# EAGLE design tubitak (EAGLE 9.6.2)
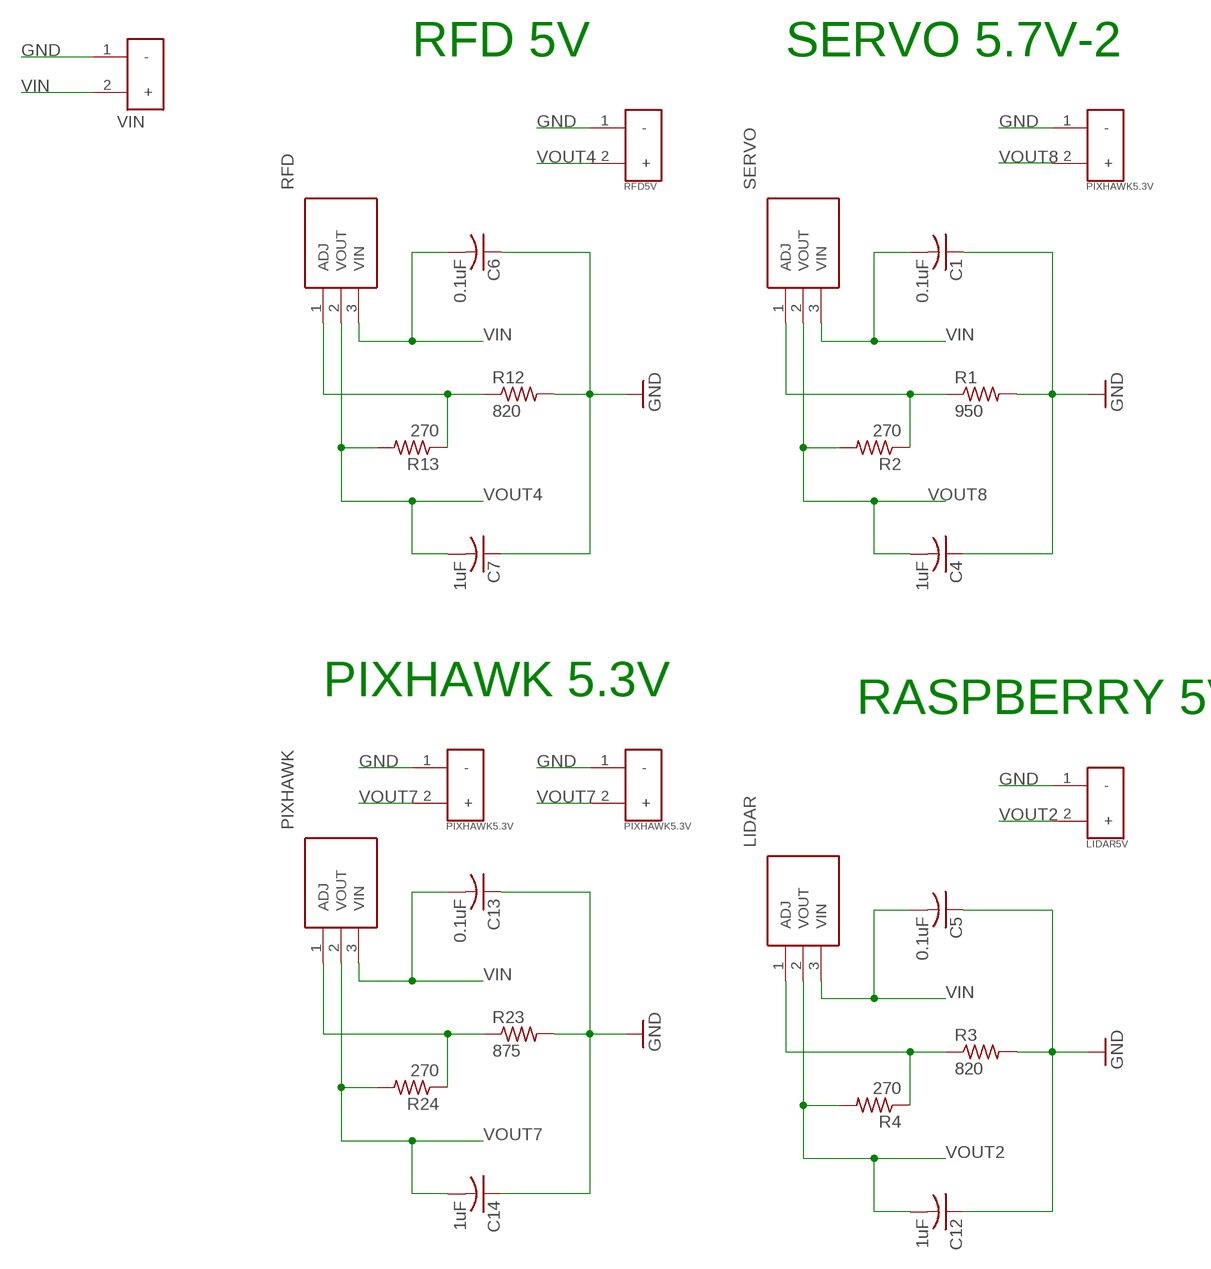
[diagram p0: schematic, sheet 1]

## Parts
C1  0.1uF  C-USC0402K  [C0402K]
C4  1uF  C-USC0402K  [C0402K]
C5  0.1uF  C-USC0402K  [C0402K]
C6  0.1uF  C-USC0402K  [C0402K]
C7  1uF  C-USC0402K  [C0402K]
C12  1uF  C-USC0402K  [C0402K]
C13  0.1uF  C-USC0402K  [C0402K]
C14  1uF  C-USC0402K  [C0402K]
J3  VIN  XT60-M  [AMASS_XT60-M]
PIXHAWK  PIXHAWK  LM338T_NOPB  [TO254P470X1028X1955-3P]
PIXHAWK5.3V-1  PIXHAWK5.3V  XT60-M  [AMASS_XT60-M]
PIXHAWK5.3V-2  PIXHAWK5.3V  XT60-M  [AMASS_XT60-M]
R1  950  R-US_R0805  [R0805]
R2  270  R-US_R0805  [R0805]
R3  820  R-US_R0805  [R0805]
R4  270  R-US_R0805  [R0805]
R12  820  R-US_R0805  [R0805]
R13  270  R-US_R0805  [R0805]
R23  875  R-US_R0805  [R0805]
R24  270  R-US_R0805  [R0805]
RASPBERRY  LIDAR  LM338T_NOPB  [TO254P470X1028X1955-3P]
RASPBERRY5V  LIDAR5V  XT60-M  [AMASS_XT60-M]
RFD  RFD  LM338T_NOPB  [TO254P470X1028X1955-3P]
RFD5V  RFD5V  XT60-M  [AMASS_XT60-M]
SERVO5.7V-2  PIXHAWK5.3V  XT60-M  [AMASS_XT60-M]
SERVO-2  SERVO  LM338T_NOPB  [TO254P470X1028X1955-3P]

## Nets
GND [asda]: C1.1 C4.1 C5.1 C6.1 C7.1 C12.1 C13.1 C14.1 J3.1(-) PIXHAWK5.3V-1.1(-) PIXHAWK5.3V-2.1(-) R1.2 R3.2 R12.2 R23.2 RASPBERRY5V.1(-) RFD5V.1(-) SERVO5.7V-2.1(-)
N$1: R1.1 R2.1 SERVO-2.1(ADJ)
N$2: R3.1 R4.1 RASPBERRY.1(ADJ)
N$11: R12.1 R13.1 RFD.1(ADJ)
N$17: PIXHAWK.1(ADJ) R23.1 R24.1
VIN [asda]: C1.2 C5.2 C6.2 C13.2 J3.2(+) PIXHAWK.3(VIN) RASPBERRY.3(VIN) RFD.3(VIN) SERVO-2.3(VIN)
VOUT2: C12.2 R4.2 RASPBERRY5V.2(+) RASPBERRY.2(VOUT)
VOUT4: C7.2 R13.2 RFD5V.2(+) RFD.2(VOUT)
VOUT7: C14.2 PIXHAWK5.3V-1.2(+) PIXHAWK5.3V-2.2(+) PIXHAWK.2(VOUT) R24.2
VOUT8: C4.2 R2.2 SERVO5.7V-2.2(+) SERVO-2.2(VOUT)

## Notes on the sheet
- RFD 5V | SERVO 5.7V-2
- PIXHAWK 5.3V
- RASPBERRY 5V

## Library data of the parts
C1 C4-C7 C12-C14 = adafruit:C-US: CAPACITOR, American symbol
J3 PIXHAWK5.3V-1 PIXHAWK5.3V-2 RASPBERRY5V RFD5V SERVO5.7V-2 = XT60-M:XT60-M: DC supply; XT60; male; PIN:2; for cable; soldered; 60A; 500V; AVAILABILITY: Unavailable; DESCRIPTION: Plug; DC supply; XT60; male; PIN: 2; for cable; soldered; 30A; 500V; MF: AMASS; MP: XT60-M; PACKAGE: Package; PRICE: None
PIXHAWK RASPBERRY RFD SERVO-2 = LM338T_NOPB:LM338T_NOPB: 5 Amp Adjustable Regulator LM338T LM338T/NOPB, Voltage Regulator, 5A Adjustable 1.2 32 V, 25W, 3-Pin TO-220 Source: Datasheet <http://www.ti.com/lit/ds/symlink/lm338.pdf>; ARROW_PART_NUMBER: LM338T/NOPB; ARROW_PRICE-STOCK: https://www.arrow.com/en/products/lm338tnopb/texas-instruments; DESCRIPTION: 5 Amp Adjustable Regulator LM338T LM338T/NOPB, Voltage Regulator, 5A Adjustable 1.2 32 V, 25W, 3-Pin TO-220; HEIGHT: 4.7mm; MANUFACTURER_NAME: Texas Instruments; MANUFACTURER_PART_NUMBER: LM338T/NOPB; MOUSER_PART_NUMBER: 926-LM338T/NOPB; MOUSER_PRICE-STOCK: https://www.mouser.co.uk/ProductDetail/Texas-Instruments/LM338T-NOPB?qs=X1J7HmVL2ZENaH7%2FMvkSlw%3D%3D
R1-R4 R12 R13 R23 R24 = adafruit:R-US_: RESISTOR, American symbol

## Net classes
1 asda: width 0.7 mm

## Board
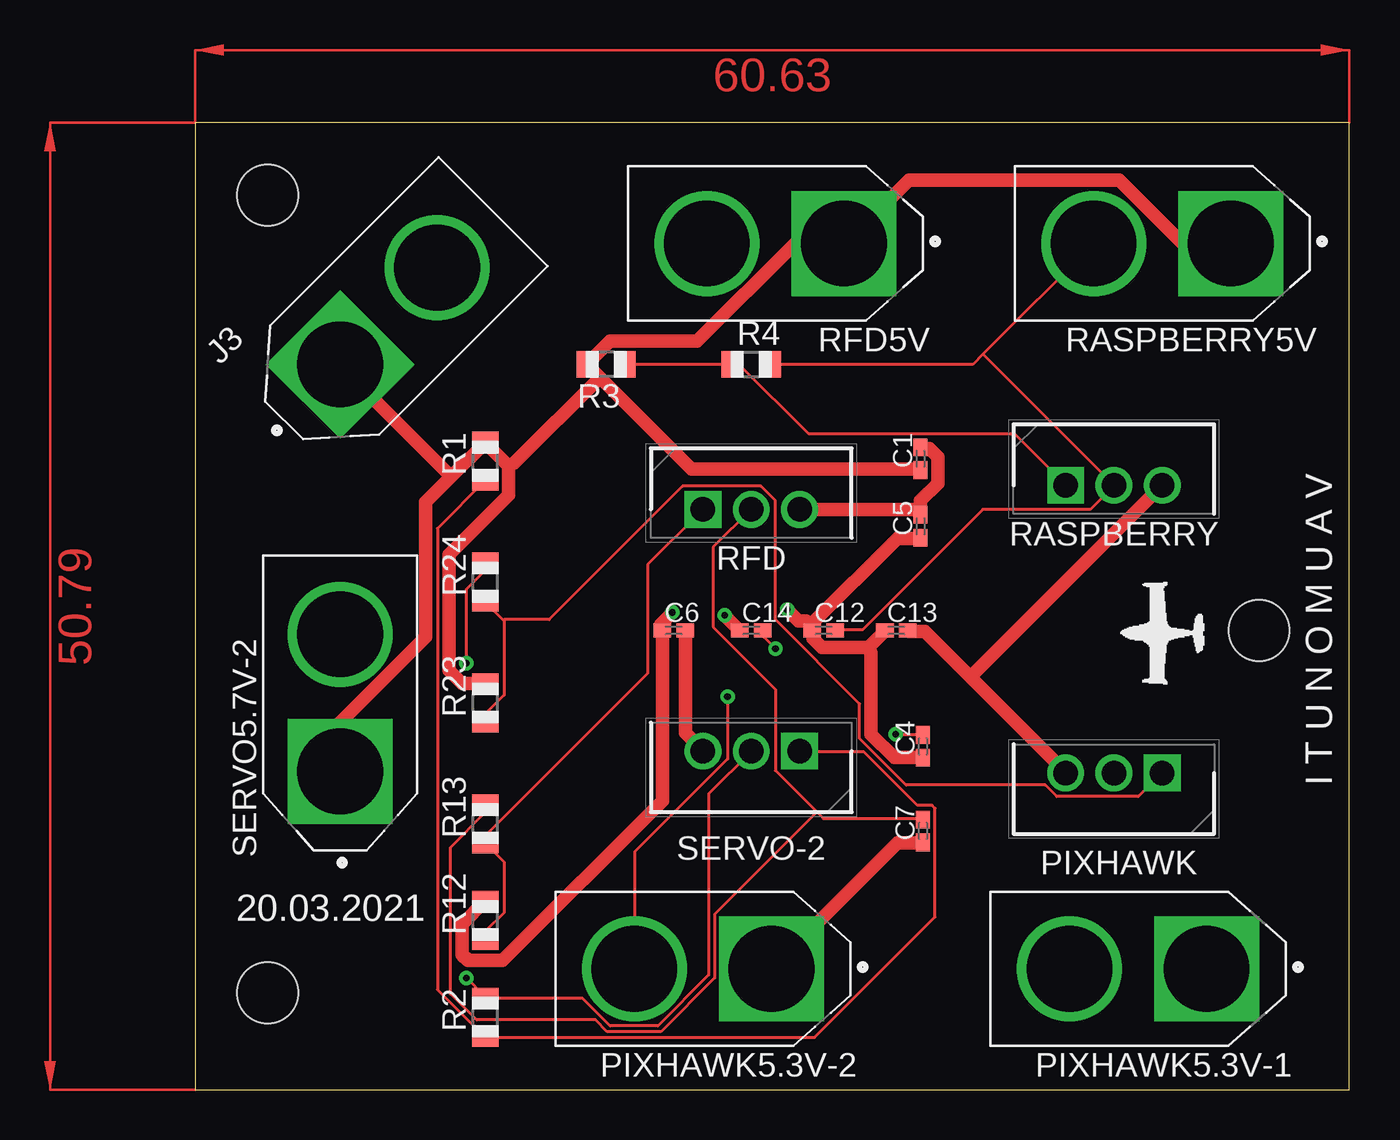
[diagram p1: board, top side]
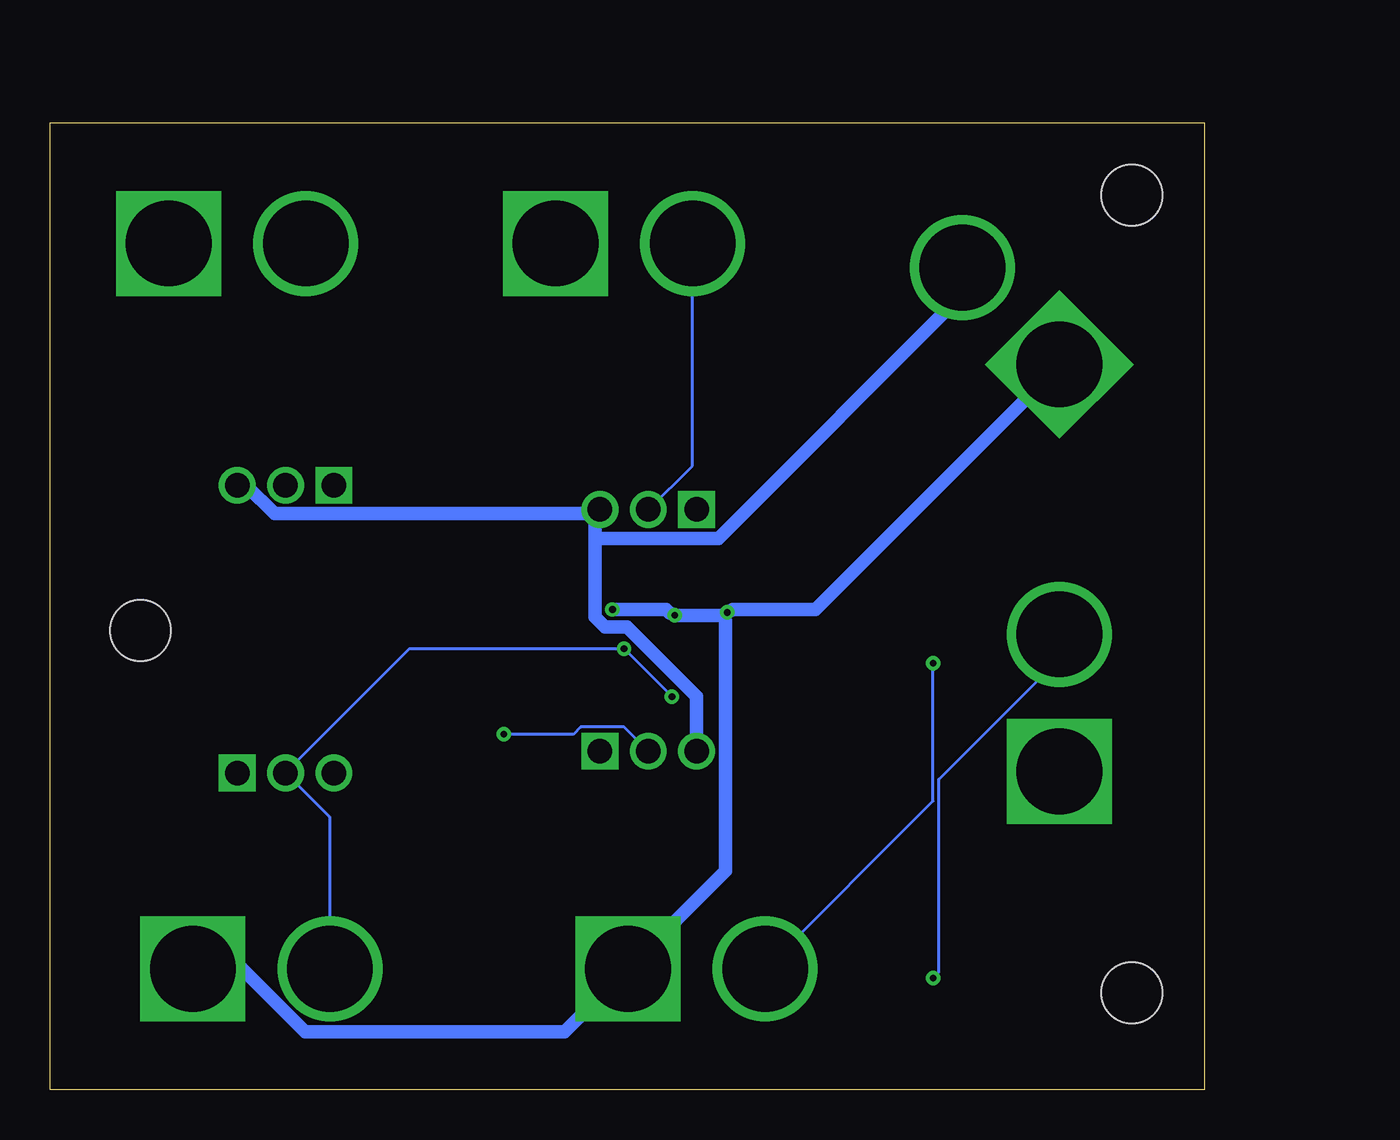
[diagram p2: board, bottom side, seen from below]

Size 60.63 x 50.79 mm. Coordinates in mm from the lower left corner, seen from the top.
Outline: 0,0 60.63,0 60.63,50.79 0,50.79 0,0
Copper layers (1*16): Top 0.035mm / dielectric 1.5mm / Bottom 0.035mm
Design rules "default": minimum track width 6mil, minimum drill 0.35mm, track to track 6mil, track to pad 6mil, pad to pad 6mil, via to via 6mil, smd to smd 6mil, copper to edge 40mil, drill to drill 6mil, minimum pad ring 10mil, minimum via ring 8mil, stop-mask expansion 4mil, vias tented up to drill 0mil, thermal gap 10mil
Holes 3.2 mm at 3.81,46.99 3.81,5.08 55.88,24.13

### Footprints (pad centres in the part's own frame; a part is rotated, then mirrored left to right if it is on the bottom)
C0402K = smd 0.925 x 0.74: 1 -0.6,0; 2 0.6,0
AMASS_XT60-M = drill 4.5 square: 1 -3.6,0 | drill 4.5: 2 3.6,0
TO254P470X1028X1955-3P = drill 1.29 pad 1.935 square: 1 0,0 | drill 1.29 pad 1.935: 2 2.54,0; 3 5.08,0
R0805 = smd 1.1 x 1.4: 1 -1,0; 2 1,0

### Placement (x,y rotation side)
C1  38.1,33.15 90 top
C4  38.23,18.03 90 top
C5  38.1,29.59 90 top
C6  25.15,24.13 0 top
C7  38.23,13.59 90 top
C12  33.02,24.13 0 top
C13  36.83,24.13 0 top
C14  29.21,24.13 0 top
J3  10.16,40.64 45 top
PIXHAWK  50.8,16.64 180 top
PIXHAWK5.3V-1  49.53,6.35 180 top
PIXHAWK5.3V-2  26.67,6.35 180 top
R1  15.24,33.02 90 top
R2  15.24,3.81 90 top
R3  21.59,38.1 180 top
R4  29.21,38.1 0 top
R12  15.24,8.89 90 top
R13  15.24,13.97 90 top
R23  15.24,20.32 90 top
R24  15.24,26.67 90 top
RASPBERRY  45.72,31.75 0 top
RASPBERRY5V  50.8,44.45 180 top
RFD  26.67,30.48 0 top
RFD5V  30.48,44.45 180 top
SERVO5.7V-2  7.62,20.32 90 top
SERVO-2  31.75,17.78 180 top

### Tracks (layer width: path | path; a pad name or v marks a point on that pad's centre or on a via)
GND  (via drill 0.35)
  Top 0.7: 35.36,23.24 32.92,23.24 32.46,23.7 32.46,24.08 C12.1 32.38,24.46 | 35.36,23.24 36.2,24.08 C13.1 | 32.38,24.46 36.88,28.96 38.1,28.96 C5.1 | C4.1 38.18,17.45 36.73,17.45 35.51,18.67 35.51,22.94 35.36,23.24 | R12.2 15.24,9.91 14.02,8.69 14.02,7.09 14.33,6.78 16.15,6.78 24.54,15.16 24.54,24.08 C6.1 24.46,24.46 v25.07,25.07 | v27.81,24.92 28.57,24.16 C14.1 | v31.09,25.22 31.7,24.61 32.08,24.61 32.38,24.46 | C7.1 38.18,12.95 36.88,12.95 30.33,6.4 PIXHAWK5.3V-2.1 | 16.46,32.77 16.46,31.24 13.34,28.12 13.34,22.02 14.02,21.34 15.24,21.34 R23.2 | 16.46,32.77 15.24,33.98 R1.2 15.01,33.76 13.45,32.19 | 21.26,37.41 20.57,38.1 R3.2 20.8,38.33 21.79,39.32 26.36,39.32 31.47,44.42 34.06,44.42 RFD5V.1 34.37,44.65 37.49,47.78 48.54,47.78 51.82,44.5 54.33,44.5 RASPBERRY5V.1 | 21.26,37.41 26.06,32.61 38.1,32.61 C1.1 | 21.26,37.41 16.76,32.92 16.46,32.77 | SERVO5.7V-2.1 7.62,19.28 12.12,23.77 12.12,30.86 13.45,32.19 | 13.45,32.19 7.62,38.02 J3.1
  Bottom 0.7: 25.22,24.92 v27.81,24.92 28.12,25.07 28.27,25.22 v31.09,25.22 | 25.22,24.92 v25.07,25.07 24.77,25.22 20.42,25.22 7.62,38.02 J3.1 | PIXHAWK5.3V-1.1 53.11,6.33 50.52,6.33 47.24,3.05 33.6,3.05 30.33,6.33 PIXHAWK5.3V-2.1 30.02,6.63 25.15,11.51 25.15,24.61 25.22,24.92
N$1
  Top 0.152: R1.1 15.24,32 12.72,29.49 12.72,5.26 14.63,3.35 14.71,3.35 R2.1 15.24,2.74 32.54,2.74 38.86,9.07 38.86,14.78 38.71,14.94 37.95,14.94 35.13,17.75 31.77,17.75 SERVO-2.1
N$2
  Top 0.152: R3.1 R4.1 28.57,38.1 32.23,34.44 43.05,34.44 45.72,31.77 RASPBERRY.1
N$11
  Top 0.152: R12.1 15.24,8.31 16.23,9.3 16.23,11.96 15.24,12.95 R13.1 15.24,13.34 23.77,21.87 23.77,27.58 RFD.1
N$17
  Top 0.152: R23.1 15.24,19.74 16.23,20.73 16.23,24.61 16.19,24.65 | 16.19,24.65 15.24,25.6 R24.1 | 16.19,24.65 16.23,24.69 18.59,24.69 25.6,31.7 29.72,31.7 30.48,30.94 30.48,24.69 34.9,20.27 34.9,18.44 37.34,16 44.65,16 45.26,15.39 49.53,15.39 50.75,16.61 PIXHAWK.1
VIN
  Top 0.7: 40.73,21.68 45.72,16.69 PIXHAWK.3 | 40.73,21.68 38.33,24.08 37.49,24.08 C13.2 | 40.73,21.68 RASPBERRY.3 | C6.2 25.76,24.08 25.76,18.75 26.67,17.83 SERVO-2.3 | C1.2 38.1,33.68 38.56,33.68 39.01,33.22 39.01,31.85 38.1,30.94 C5.2 37.8,30.48 RFD.3
  Bottom 0.7: SERVO-2.3 26.67,20.65 30.33,24.31 31.47,24.31 32,24.84 32,28.96 | 32,28.96 32,30.25 31.77,30.48 RFD.3 32.31,30.25 48.84,30.25 50.29,31.7 50.75,31.7 RASPBERRY.3 | 32,28.96 25.53,28.96 12.72,41.76 12.72,43.13 J3.2
VOUT2
  Top 0.152: C12.2 33.68,24.16 35.05,24.16 41.38,30.48 47.02,30.48 48.23,31.7 RASPBERRY.2 41.38,38.63 | R4.2 40.84,38.1 41.38,38.63 | 41.38,38.63 47.17,44.42 RASPBERRY5V.2
VOUT4
  Top 0.152: 32.65,14.59 30.48,16.76 30.48,21.03 27.2,24.31 27.2,28.5 29.18,30.48 RFD.2 | 32.65,14.59 32.99,14.25 38.18,14.25 C7.2 | R13.2 15.24,14.55 13.41,12.72 13.41,5.03 14.78,3.66 21.03,3.66 21.64,3.05 24.46,3.05 27.28,5.87 27.28,9.22 32.65,14.59
  Bottom 0.152: RFD5V.2 26.9,44.42 26.9,32.77 29.18,30.48 RFD.2
VOUT7  (via drill 0.35)
  Top 0.152: R24.2 15.24,27.28 14.25,26.29 v14.25,22.4 | v30.48,23.16 29.87,23.77 29.87,24.08 C14.2 | v27.96,20.65 27.96,17.37 23.09,12.5 23.09,6.4 PIXHAWK5.3V-2.2
  Bottom 0.152: v14.25,22.4 14.25,15.16 23.01,6.4 PIXHAWK5.3V-2.2 | PIXHAWK5.3V-1.2 45.95,6.4 45.95,14.33 PIXHAWK.2 48.23,16.69 41.76,23.16 v30.48,23.16 v27.96,20.65
VOUT8  (via drill 0.35)
  Top 0.152: v36.8,18.67 38.18,18.67 C4.2 | SERVO-2.2 26.98,15.54 26.98,6.02 24.31,3.35 21.79,3.35 20.34,4.8 R2.2 15.24,4.88 v14.25,5.87
  Bottom 0.152: v36.8,18.67 33.15,18.67 32.77,19.05 30.48,19.05 SERVO-2.2 | SERVO5.7V-2.2 7.62,22.63 13.95,16.31 13.95,6.17 v14.25,5.87
(copper drawn outside any net)
  shapes: Top area x2

### Text on the board
tNames: I T U N O M U A V | 20.03.2021